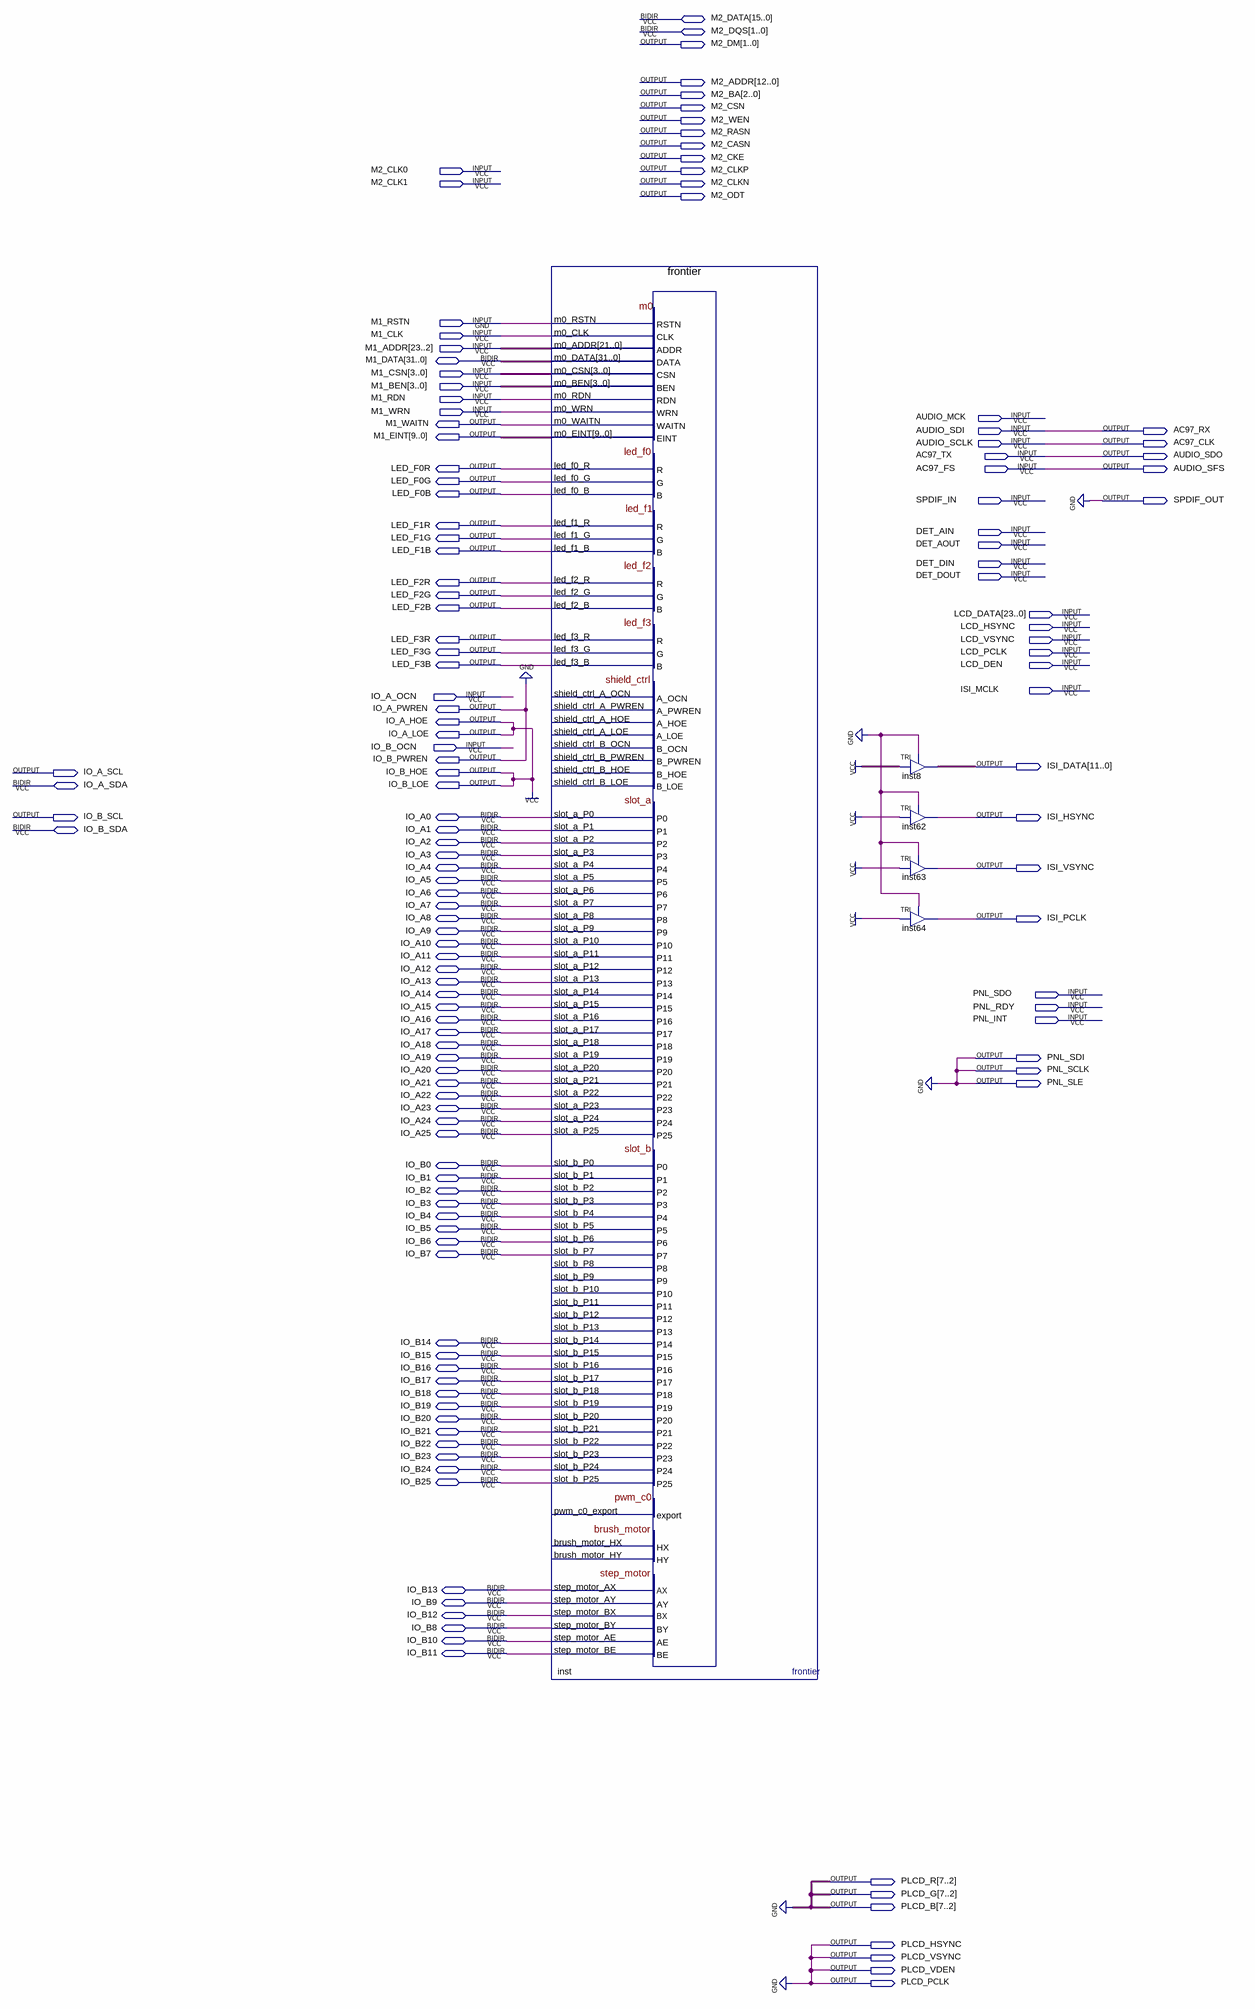
[diagram p0: schematic sheet]
// Quartus schematic grid.bdf as structural Verilog: 5 symbols, 139 pins
module grid (
  input  M2_CLK0,
  input  M2_CLK1,
  input  M1_RSTN,
  input  M1_CLK,
  input  [23:2] M1_ADDR,
  input  [3:0] M1_CSN,
  input  [3:0] M1_BEN,
  input  M1_RDN,
  input  M1_WRN,
  input  AUDIO_MCK,
  input  AUDIO_SDI,
  input  AUDIO_SCLK,
  input  AC97_TX,
  input  AC97_FS,
  input  SPDIF_IN,
  input  DET_AIN,
  input  DET_AOUT,
  input  DET_DIN,
  input  DET_DOUT,
  input  [23:0] LCD_DATA,
  input  LCD_HSYNC,
  input  LCD_VSYNC,
  input  LCD_PCLK,
  input  LCD_DEN,
  input  ISI_MCLK,
  input  IO_A_OCN,
  input  IO_B_OCN,
  input  PNL_SDO,
  input  PNL_RDY,
  input  PNL_INT,
  inout  [15:0] M2_DATA,
  inout  [1:0] M2_DQS,
  inout  [31:0] M1_DATA,
  inout  IO_A_SDA,
  inout  IO_A0,
  inout  IO_B_SDA,
  inout  IO_A1,
  inout  IO_A2,
  inout  IO_A3,
  inout  IO_A4,
  inout  IO_A5,
  inout  IO_A6,
  inout  IO_A7,
  inout  IO_A8,
  inout  IO_A9,
  inout  IO_A10,
  inout  IO_A11,
  inout  IO_A12,
  inout  IO_A13,
  inout  IO_A14,
  inout  IO_A15,
  inout  IO_A16,
  inout  IO_A17,
  inout  IO_A18,
  inout  IO_A19,
  inout  IO_A20,
  inout  IO_A21,
  inout  IO_A22,
  inout  IO_A23,
  inout  IO_A24,
  inout  IO_A25,
  inout  IO_B0,
  inout  IO_B1,
  inout  IO_B2,
  inout  IO_B3,
  inout  IO_B4,
  inout  IO_B5,
  inout  IO_B6,
  inout  IO_B7,
  inout  IO_B14,
  inout  IO_B15,
  inout  IO_B16,
  inout  IO_B17,
  inout  IO_B18,
  inout  IO_B19,
  inout  IO_B20,
  inout  IO_B21,
  inout  IO_B22,
  inout  IO_B23,
  inout  IO_B24,
  inout  IO_B25,
  inout  IO_B13,
  inout  IO_B9,
  inout  IO_B12,
  inout  IO_B8,
  inout  IO_B10,
  inout  IO_B11,
  output [1:0] M2_DM,
  output [12:0] M2_ADDR,
  output [2:0] M2_BA,
  output M2_CSN,
  output M2_WEN,
  output M2_RASN,
  output M2_CASN,
  output M2_CKE,
  output M2_CLKP,
  output M2_CLKN,
  output M2_ODT,
  output M1_WAITN,
  output AC97_RX,
  output [9:0] M1_EINT,
  output AC97_CLK,
  output AUDIO_SDO,
  output LED_F0R,
  output AUDIO_SFS,
  output LED_F0G,
  output LED_F0B,
  output SPDIF_OUT,
  output LED_F1R,
  output LED_F1G,
  output LED_F1B,
  output LED_F2R,
  output LED_F2G,
  output LED_F2B,
  output LED_F3R,
  output LED_F3G,
  output LED_F3B,
  output IO_A_PWREN,
  output IO_A_HOE,
  output IO_A_LOE,
  output IO_B_PWREN,
  output [11:0] ISI_DATA,
  output IO_A_SCL,
  output IO_B_HOE,
  output IO_B_LOE,
  output IO_B_SCL,
  output ISI_HSYNC,
  output ISI_VSYNC,
  output ISI_PCLK,
  output PNL_SDI,
  output PNL_SCLK,
  output PNL_SLE,
  output [7:2] PLCD_R,
  output [7:2] PLCD_G,
  output [7:2] PLCD_B,
  output PLCD_HSYNC,
  output PLCD_VSYNC,
  output PLCD_VDEN,
  output PLCD_PCLK
);

  frontier inst (
    .m0_RSTN(M1_RSTN), .m0_CLK(M1_CLK), .m0_ADDR(M1_ADDR), .m0_CSN(M1_CSN), .m0_BEN(M1_BEN), .m0_RDN(M1_RDN),
    .m0_WRN(M1_WRN), .m0_WAITN(M1_WAITN), .m0_EINT(M1_EINT), .led_f0_R(LED_F0R), .led_f0_G(LED_F0G),
    .led_f0_B(LED_F0B), .led_f1_R(LED_F1R), .led_f1_G(LED_F1G), .led_f1_B(LED_F1B), .led_f2_R(LED_F2R),
    .led_f2_G(LED_F2G), .led_f2_B(LED_F2B), .led_f3_R(LED_F3R), .led_f3_G(LED_F3G), .led_f3_B(LED_F3B),
    .step_motor_AX(IO_B13), .step_motor_AY(IO_B9), .step_motor_BX(IO_B12), .step_motor_BY(IO_B8),
    .step_motor_AE(IO_B10), .step_motor_BE(IO_B11), .m0_DATA(M1_DATA), .slot_a_P0(IO_A0), .slot_a_P1(IO_A1),
    .slot_a_P2(IO_A2), .slot_a_P3(IO_A3), .slot_a_P4(IO_A4), .slot_a_P5(IO_A5), .slot_a_P6(IO_A6),
    .slot_a_P7(IO_A7), .slot_a_P8(IO_A8), .slot_a_P9(IO_A9), .slot_a_P10(IO_A10), .slot_a_P11(IO_A11),
    .slot_a_P12(IO_A12), .slot_a_P13(IO_A13), .slot_a_P14(IO_A14), .slot_a_P15(IO_A15), .slot_a_P16(IO_A16),
    .slot_a_P17(IO_A17), .slot_a_P18(IO_A18), .slot_a_P19(IO_A19), .slot_a_P20(IO_A20), .slot_a_P21(IO_A21),
    .slot_a_P22(IO_A22), .slot_a_P23(IO_A23), .slot_a_P24(IO_A24), .slot_a_P25(IO_A25), .slot_b_P0(IO_B0),
    .slot_b_P1(IO_B1), .slot_b_P2(IO_B2), .slot_b_P3(IO_B3), .slot_b_P4(IO_B4), .slot_b_P5(IO_B5),
    .slot_b_P6(IO_B6), .slot_b_P7(IO_B7), .slot_b_P14(IO_B14), .slot_b_P15(IO_B15), .slot_b_P16(IO_B16),
    .slot_b_P17(IO_B17), .slot_b_P18(IO_B18), .slot_b_P19(IO_B19), .slot_b_P20(IO_B20), .slot_b_P21(IO_B21),
    .slot_b_P22(IO_B22), .slot_b_P23(IO_B23), .slot_b_P24(IO_B24), .slot_b_P25(IO_B25));  // open: shield_ctrl_A_OCN, shield_ctrl_B_OCN, shield_ctrl_A_PWREN, shield_ctrl_A_HOE, shield_ctrl_A_LOE, shield_ctrl_B_PWREN, shield_ctrl_B_HOE, shield_ctrl_B_LOE, pwm_c0_export, brush_motor_HX, brush_motor_HY, slot_b_P8, slot_b_P9, slot_b_P10, slot_b_P11, slot_b_P12, slot_b_P13
  TRI inst8[11:0] (.IN({12{1'b1}}), .OE(1'b0), .OUT(ISI_DATA));
  TRI inst62 (.IN(1'b1), .OE(1'b0), .OUT(ISI_HSYNC));
  TRI inst63 (.IN(1'b1), .OE(1'b0), .OUT(ISI_VSYNC));
  TRI inst64 (.IN(1'b1), .OE(1'b0), .OUT(ISI_PCLK));

  assign AC97_CLK = AUDIO_SCLK;
  assign AC97_RX = AUDIO_SDI;
  assign AUDIO_SDO = AC97_TX;
  assign AUDIO_SFS = AC97_FS;
  assign IO_A_HOE = 1'b1;
  assign IO_A_LOE = 1'b1;
  assign IO_A_PWREN = 1'b0;
  assign IO_B_HOE = 1'b1;
  assign IO_B_LOE = 1'b1;
  assign IO_B_PWREN = 1'b0;
  assign PLCD_B = {6{1'b0}};
  assign PLCD_G = {6{1'b0}};
  assign PLCD_HSYNC = 1'b0;
  assign PLCD_PCLK = 1'b0;
  assign PLCD_R = {6{1'b0}};
  assign PLCD_VDEN = 1'b0;
  assign PLCD_VSYNC = 1'b0;
  assign PNL_SCLK = 1'b0;
  assign PNL_SDI = 1'b0;
  assign PNL_SLE = 1'b0;
  assign SPDIF_OUT = 1'b0;
endmodule
